# Altium schematic sheet mcu-power.schdoc: MCUA
size A4; Date: 10.25.2025; CheckedBy: BCY; DrawnBy: miaow; DocumentNumber: 12; Revision: v1.0.0; SheetNumber: 12; SheetTotal: 14; BoardType: MAIN_PCB; Desc: Power subpart of  MCU
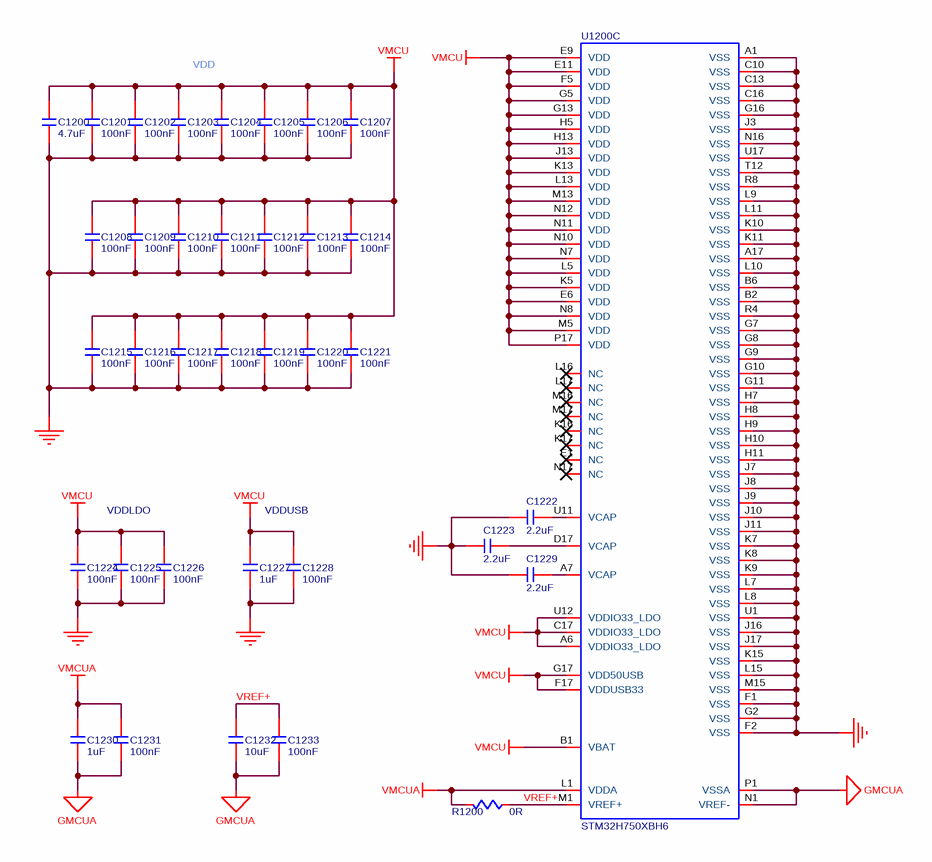
[diagram p0: mcu-power.schdoc]

## Parts
C1200  value 4.7uF  [C0603]  (hidden comment: C-NOMO)
C1201  value 100nF  [C0402]  (hidden comment: C-NOMO)
C1202  value 100nF  [C0402]  (hidden comment: C-NOMO)
C1203  value 100nF  [C0402]  (hidden comment: C-NOMO)
C1204  value 100nF  [C0402]  (hidden comment: C-NOMO)
C1205  value 100nF  [C0402]  (hidden comment: C-NOMO)
C1206  value 100nF  [C0402]  (hidden comment: C-NOMO)
C1207  value 100nF  [C0402]  (hidden comment: C-NOMO)
C1208  value 100nF  [C0402]  (hidden comment: C-NOMO)
C1209  value 100nF  [C0402]  (hidden comment: C-NOMO)
C1210  value 100nF  [C0402]  (hidden comment: C-NOMO)
C1211  value 100nF  [C0402]  (hidden comment: C-NOMO)
C1212  value 100nF  [C0402]  (hidden comment: C-NOMO)
C1213  value 100nF  [C0402]  (hidden comment: C-NOMO)
C1214  value 100nF  [C0402]  (hidden comment: C-NOMO)
C1215  value 100nF  [C0402]  (hidden comment: C-NOMO)
C1216  value 100nF  [C0402]  (hidden comment: C-NOMO)
C1217  value 100nF  [C0402]  (hidden comment: C-NOMO)
C1218  value 100nF  [C0402]  (hidden comment: C-NOMO)
C1219  value 100nF  [C0402]  (hidden comment: C-NOMO)
C1220  value 100nF  [C0402]  (hidden comment: C-NOMO)
C1221  value 100nF  [C0402]  (hidden comment: C-NOMO)
C1222  value 2.2uF  [C0402]  (hidden comment: C-NOMO)
C1223  value 2.2uF  [C0402]  (hidden comment: C-NOMO)
C1224  value 100nF  [C0402]  (hidden comment: C-NOMO)
C1225  value 100nF  [C0402]  (hidden comment: C-NOMO)
C1226  value 100nF  [C0402]  (hidden comment: C-NOMO)
C1227  value 1uF  [C0603]  (hidden comment: C-NOMO)
C1228  value 100nF  [C0402]  (hidden comment: C-NOMO)
C1229  value 2.2uF  [C0402]  (hidden comment: C-NOMO)
C1230  value 1uF  [C0603]  (hidden comment: C-NOMO)
C1231  value 100nF  [C0402]  (hidden comment: C-NOMO)
C1232  value 10uF  [C0805]  (hidden comment: C-NOMO)
C1233  value 100nF  [C0402]  (hidden comment: C-NOMO)
R1200  value 0R  [R0603]  (hidden comment: R)
U1200  STM32H750XBH6  [STM32H750XBH6]  (part C of 3)

## Nets
GMCUA: C1230.1 C1231.1 C1232.1 C1233.1 U1200.N1(VREF-) U1200.P1(VSSA)
GND: C1200.1 C1201.1 C1202.1 C1203.1 C1204.1 C1205.1 C1206.1 C1207.1 C1208.1 C1209.1 C1210.1 C1211.1 C1212.1 C1213.1 C1214.1 C1215.1 C1216.1 C1217.1 C1218.1 C1219.1 C1220.1 C1221.1 C1222.1 C1223.1 C1224.1 C1225.1 C1226.1 C1227.1 C1228.1 C1229.1 U1200.A1(VSS) U1200.A17(VSS) U1200.B2(VSS) U1200.B6(VSS) U1200.C10(VSS) U1200.C13(VSS) U1200.C16(VSS) U1200.F1(VSS) U1200.F2(VSS) U1200.G2(VSS) U1200.G7(VSS) U1200.G8(VSS) U1200.G9(VSS) U1200.G10(VSS) U1200.G11(VSS) U1200.G16(VSS) U1200.H7(VSS) U1200.H8(VSS) U1200.H9(VSS) U1200.H10(VSS) U1200.H11(VSS) U1200.J3(VSS) U1200.J7(VSS) U1200.J8(VSS) U1200.J9(VSS) U1200.J10(VSS) U1200.J11(VSS) U1200.J16(VSS) U1200.J17(VSS) U1200.K7(VSS) U1200.K8(VSS) U1200.K9(VSS) U1200.K10(VSS) U1200.K11(VSS) U1200.K15(VSS) U1200.L7(VSS) U1200.L8(VSS) U1200.L9(VSS) U1200.L10(VSS) U1200.L11(VSS) U1200.L15(VSS) U1200.M15(VSS) U1200.N16(VSS) U1200.R4(VSS) U1200.R8(VSS) U1200.T12(VSS) U1200.U1(VSS) U1200.U17(VSS)
VMCU: C1200.2 C1201.2 C1202.2 C1203.2 C1204.2 C1205.2 C1206.2 C1207.2 C1208.2 C1209.2 C1210.2 C1211.2 C1212.2 C1213.2 C1214.2 C1215.2 C1216.2 C1217.2 C1218.2 C1219.2 C1220.2 C1221.2 C1224.2 C1225.2 C1226.2 C1227.2 C1228.2 U1200.A6(VDDIO33_LDO) U1200.B1(VBAT) U1200.C17(VDDIO33_LDO) U1200.E6(VDD) U1200.E9(VDD) U1200.E11(VDD) U1200.F5(VDD) U1200.F17(VDDUSB33) U1200.G5(VDD) U1200.G13(VDD) U1200.G17(VDD50USB) U1200.H5(VDD) U1200.H13(VDD) U1200.J13(VDD) U1200.K5(VDD) U1200.K13(VDD) U1200.L5(VDD) U1200.L13(VDD) U1200.M5(VDD) U1200.M13(VDD) U1200.N7(VDD) U1200.N8(VDD) U1200.N10(VDD) U1200.N11(VDD) U1200.N12(VDD) U1200.P17(VDD) U1200.U12(VDDIO33_LDO)
VMCUA: C1230.2 C1231.2 R1200.1 U1200.L1(VDDA)
VREF+: C1232.2 C1233.2 R1200.2 U1200.M1(VREF+)
NetC1222_2: C1222.2 U1200.U11(VCAP)
NetC1223_2: C1223.2 U1200.D17(VCAP)
NetC1229_2: C1229.2 U1200.A7(VCAP)

Not connected (* = marked no-connect by the designer): U1200 E1(NC)* K16(NC)* K17(NC)* L16(NC)* L17(NC)* M16(NC)* M17(NC)* N17(NC)*

## Notes on the sheet
- VDD
- VDDLDO
- VDDUSB
- DRAWN
- CHECKED
- DRAWNBY
- SHEETS
- SHEETS_NO

## Library data of the parts
C1200-C1233 = C-NOMO: voltage: 25V; precision: 5%
R1200 = R: precision: 1%
U1200 = STM32H750XBH6: MCU; Supplier 1: LCSC; Supplier Part Number 1: C405932